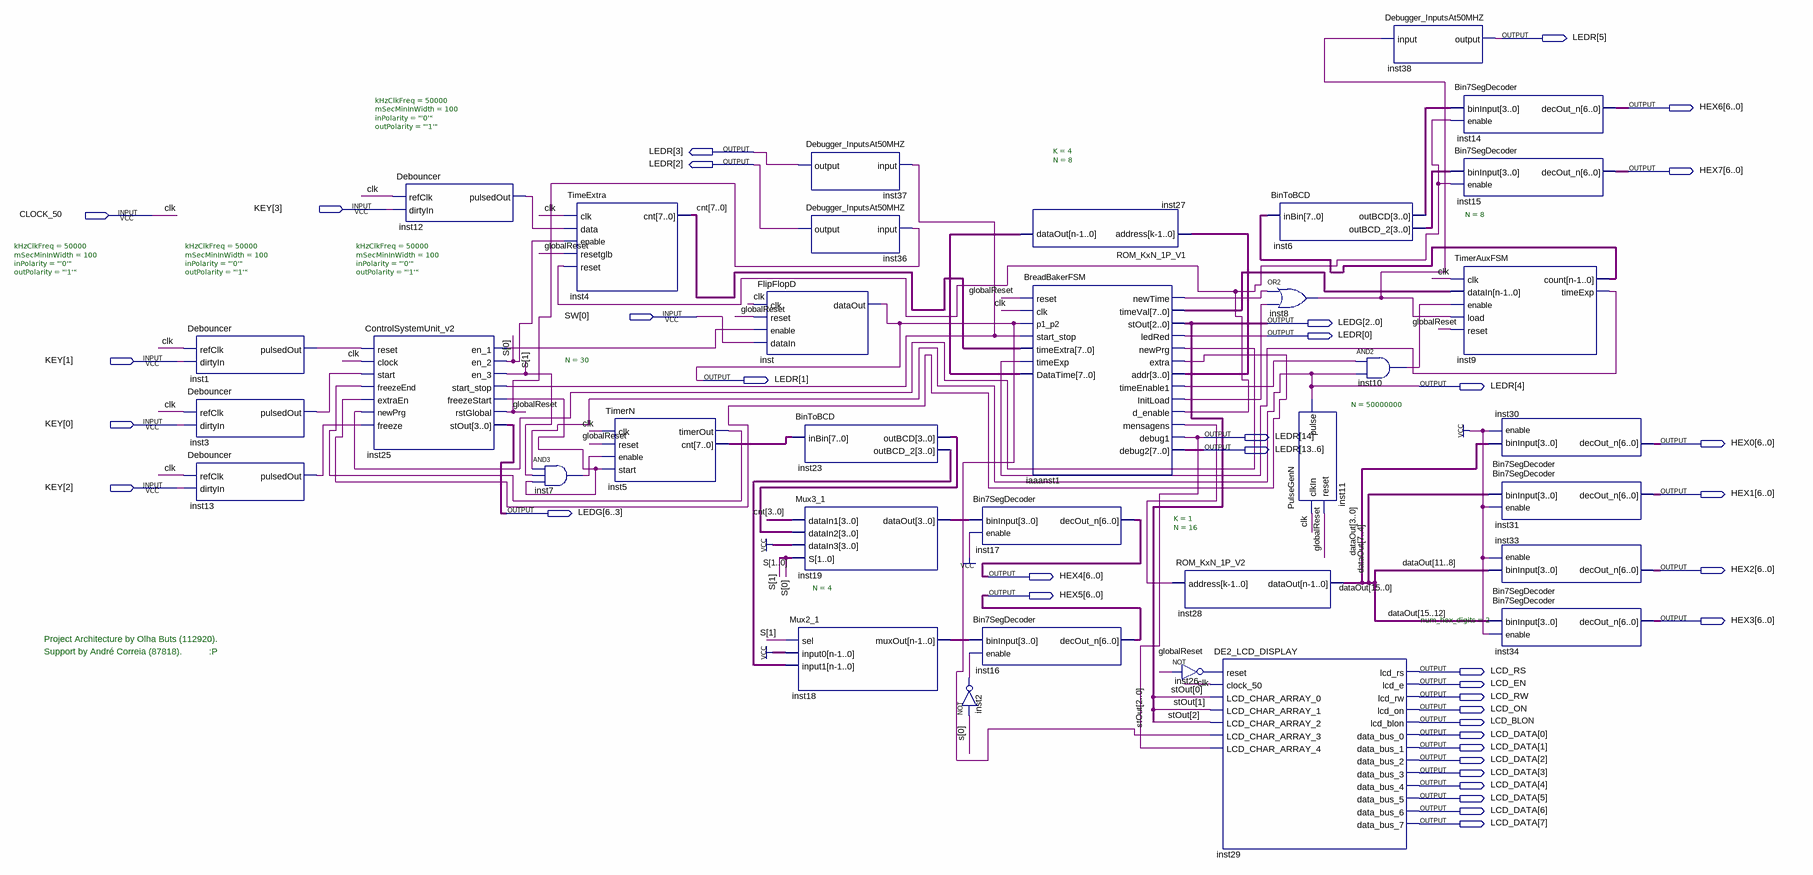
[diagram p0: schematic sheet]
// Quartus schematic BreadMaker.bdf as structural Verilog: 34 symbols, 37 pins
module BreadMaker (
  input  [3:0] KEY,
  input  CLOCK_50,
  input  [0:0] SW,
  output [14:0] LEDR,
  output [6:0] HEX6,
  output [6:0] HEX7,
  output [6:0] LEDG,
  output [6:0] HEX0,
  output [6:0] HEX1,
  output [6:0] HEX2,
  output [6:0] HEX4,
  output [6:0] HEX5,
  output [6:0] HEX3,
  output LCD_RS,
  output LCD_EN,
  output LCD_RW,
  output LCD_ON,
  output LCD_BLON,
  output [7:0] LCD_DATA
);

  wire globalReset, iaaanst1_d_enable, iaaanst1_extra, iaaanst1_initload, iaaanst1_mensagens,
       iaaanst1_newprg, iaaanst1_newtime, iaaanst1_timeenable1, inst1_pulsedout, inst2_out, inst3_pulsedout,
       inst5_timerout, inst7_out, inst8_out, inst9_timeexp, inst10_out, inst12_pulsedout, inst13_pulsedout,
       inst25_en_1, inst25_freezestart, inst25_start_stop, inst26_out;
  wire [1:0] S;
  wire [3:0] iaaanst1_addr, inst6_outbcd, inst6_outbcd_2, inst18_muxout, inst19_dataout, inst23_outbcd,
       inst23_outbcd_2;
  wire [7:0] cnt, iaaanst1_timeval, inst5_cnt, inst9_count, inst27_dataout;
  wire [15:0] dataOut;

  Debouncer #(.kHzClkFreq(50000), .mSecMinInWidth(100), .inPolarity("'0'"), .outPolarity("'1'")) inst1 (
    .refClk(CLOCK_50), .dirtyIn(KEY[1]), .pulsedOut(inst1_pulsedout));
  Debouncer #(.kHzClkFreq(50000), .mSecMinInWidth(100), .inPolarity("'0'"), .outPolarity("'1'")) inst3 (
    .refClk(CLOCK_50), .dirtyIn(KEY[0]), .pulsedOut(inst3_pulsedout));
  Debouncer #(.kHzClkFreq(50000), .mSecMinInWidth(100), .inPolarity("'0'"), .outPolarity("'1'")) inst13 (
    .refClk(CLOCK_50), .dirtyIn(KEY[2]), .pulsedOut(inst13_pulsedout));
  Debouncer #(.kHzClkFreq(50000), .mSecMinInWidth(100), .inPolarity("'0'"), .outPolarity("'1'")) inst12 (
    .refClk(CLOCK_50), .dirtyIn(KEY[3]), .pulsedOut(inst12_pulsedout));
  ControlSystemUnit_v2 inst25 (
    .reset(inst1_pulsedout), .clock(CLOCK_50), .start(inst3_pulsedout), .freezeEnd(inst5_timerout),
    .extraEn(iaaanst1_extra), .newPrg(iaaanst1_newprg), .freeze(inst13_pulsedout), .en_1(inst25_en_1),
    .en_2(S[0]), .en_3(S[1]), .start_stop(inst25_start_stop), .freezeStart(inst25_freezestart),
    .rstGlobal(globalReset), .stOut(LEDG[6:3]));
  and inst7 (inst7_out, LEDR[4], S[1], inst25_freezestart);
  TimeExtra inst4 (
    .clk(CLOCK_50), .data(inst12_pulsedout), .enable(S[0]), .resetglb(globalReset),
    .reset(iaaanst1_d_enable), .cnt(cnt));
  TimerN #(.N(30)) inst5 (
    .clk(CLOCK_50), .reset(globalReset), .enable(inst7_out), .start(inst25_freezestart),
    .timerOut(inst5_timerout), .cnt(inst5_cnt));
  FlipFlopD inst (.clk(CLOCK_50), .reset(globalReset), .enable(inst25_en_1), .dataIn(SW[0]), .dataOut(LEDR[1]));
  Debugger_InputsAt50MHZ inst37 (.\input (inst25_start_stop), .\output (LEDR[3]));
  Debugger_InputsAt50MHZ inst36 (.\input (globalReset), .\output (LEDR[2]));
  BinToBCD inst23 (.inBin(inst5_cnt), .outBCD(inst23_outbcd), .outBCD_2(inst23_outbcd_2));
  Mux3_1 inst19 (.dataIn1(cnt[3:0]), .dataIn2(inst23_outbcd), .dataIn3(4'b1111), .S(S), .dataOut(inst19_dataout));
  Mux2_1 #(.N(4)) inst18 (.sel(S[1]), .input0(4'b1111), .input1(inst23_outbcd_2), .muxOut(inst18_muxout));
  not inst2 (inst2_out, S[0]);
  Bin7SegDecoder inst17 (.binInput(inst19_dataout), .enable(1'b1), .decOut_n(HEX4));
  Bin7SegDecoder inst16 (.binInput(inst18_muxout), .enable(inst2_out), .decOut_n(HEX5));
  ROM_KxN_1P_V1 #(.K(4), .N(8)) inst27 (.address(iaaanst1_addr), .dataOut(inst27_dataout));
  BreadBakerFSM iaaanst1 (
    .reset(globalReset), .clk(CLOCK_50), .p1_p2(LEDR[1]), .start_stop(inst25_start_stop), .timeExtra(cnt),
    .timeExp(inst9_timeexp), .DataTime(inst27_dataout), .newTime(iaaanst1_newtime),
    .timeVal(iaaanst1_timeval), .stOut(LEDG[2:0]), .ledRed(LEDR[0]), .newPrg(iaaanst1_newprg),
    .extra(iaaanst1_extra), .addr(iaaanst1_addr), .timeEnable1(iaaanst1_timeenable1),
    .InitLoad(iaaanst1_initload), .d_enable(iaaanst1_d_enable), .mensagens(iaaanst1_mensagens),
    .debug1(LEDR[14]), .debug2(LEDR[13:6]));
  ROM_KxN_1P_V2 #(.K(1), .N(16)) inst28 (.address(iaaanst1_mensagens), .dataOut(dataOut));
  DE2_LCD_DISPLAY #(.num_hex_digits(2)) inst29 (
    .reset(inst26_out), .clock_50(CLOCK_50), .LCD_CHAR_ARRAY_0(LEDG[0]), .LCD_CHAR_ARRAY_1(LEDG[1]),
    .LCD_CHAR_ARRAY_2(LEDG[2]), .LCD_CHAR_ARRAY_3(LEDR[1]), .LCD_CHAR_ARRAY_4(LEDR[14]), .lcd_rs(LCD_RS),
    .lcd_e(LCD_EN), .lcd_rw(LCD_RW), .lcd_on(LCD_ON), .lcd_blon(LCD_BLON), .data_bus_0(LCD_DATA[0]),
    .data_bus_1(LCD_DATA[1]), .data_bus_2(LCD_DATA[2]), .data_bus_3(LCD_DATA[3]), .data_bus_4(LCD_DATA[4]),
    .data_bus_5(LCD_DATA[5]), .data_bus_6(LCD_DATA[6]), .data_bus_7(LCD_DATA[7]));
  not inst26 (inst26_out, globalReset);
  BinToBCD inst6 (.inBin(inst9_count), .outBCD(inst6_outbcd), .outBCD_2(inst6_outbcd_2));
  or inst8 (inst8_out, iaaanst1_newtime, iaaanst1_initload);
  PulseGenN #(.N(50000000)) inst11 (.clkIn(CLOCK_50), .reset(globalReset), .pulse(LEDR[4]));
  and inst10 (inst10_out, iaaanst1_timeenable1, LEDR[4]);
  Debugger_InputsAt50MHZ inst38 (.\input (inst8_out), .\output (LEDR[5]));
  Bin7SegDecoder inst14 (.binInput(inst6_outbcd), .enable(iaaanst1_d_enable), .decOut_n(HEX6));
  Bin7SegDecoder inst15 (.binInput(inst6_outbcd_2), .enable(iaaanst1_d_enable), .decOut_n(HEX7));
  TimerAuxFSM #(.N(8)) inst9 (
    .clk(CLOCK_50), .dataIn(iaaanst1_timeval), .enable(inst10_out), .load(inst8_out), .reset(globalReset),
    .count(inst9_count), .timeExp(inst9_timeexp));
  Bin7SegDecoder inst30 (.binInput(dataOut[3:0]), .enable(1'b1), .decOut_n(HEX0));
  Bin7SegDecoder inst31 (.binInput(dataOut[7:4]), .enable(1'b1), .decOut_n(HEX1));
  Bin7SegDecoder inst33 (.binInput(dataOut[11:8]), .enable(1'b1), .decOut_n(HEX2));
  Bin7SegDecoder inst34 (.binInput(dataOut[15:12]), .enable(1'b1), .decOut_n(HEX3));

  // Other names for the same wires on the sheet: clk = CLOCK_50; stOut[2:0] = LEDG[2:0]

  // Notes on the sheet:
  //   Project Architecture by Olha Buts (112920).
  //   Support by André Correia (87818).
  //   :P
endmodule
